# Altium schematic sheet mcu.SchDoc: AudioBound - MCU
size Letter; CheckedBy: J. Brinton; CompanyName: Brinton Engineering, LLC; DrawnBy: J. Brinton; Engineer: J. Brinton; Address1: 3479 Edison Way; Address2: Menlo Park CA 94025; Revision: 1; SheetNumber: 2; SheetTotal: 2
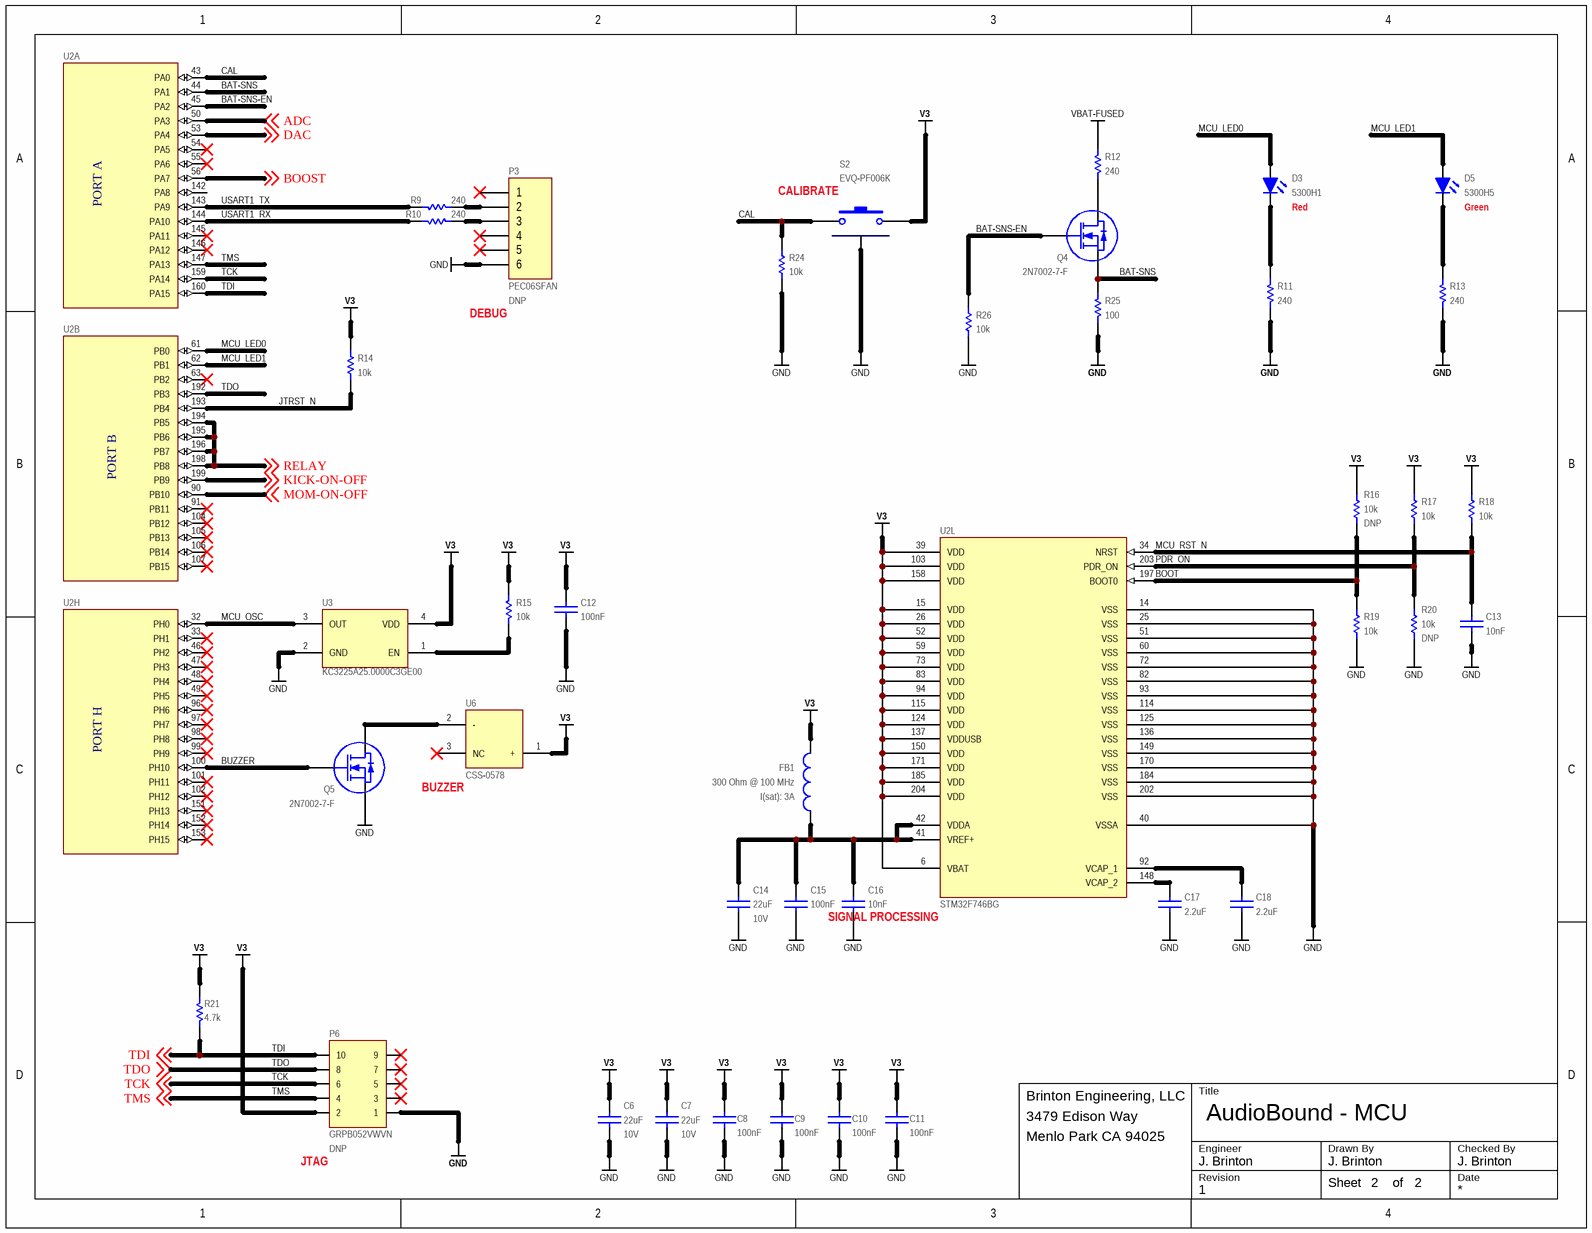
[diagram p0: mcu.SchDoc]

## Parts
C6  value 22uF  Voltage: 10V  [CAPC200X125X145L45N]  (hidden comment: C2012X7S1A226M125)
C7  value 22uF  Voltage: 10V  [CAPC200X125X145L45N]  (hidden comment: C2012X7S1A226M125)
C8  value 100nF  [CAPC100X50X55L25N]  (hidden comment: GCM155R71H104KE02)
C9  value 100nF  [CAPC100X50X55L25N]  (hidden comment: GCM155R71H104KE02)
C10  value 100nF  [CAPC100X50X55L25N]  (hidden comment: GCM155R71H104KE02)
C11  value 100nF  [CAPC100X50X55L25N]  (hidden comment: GCM155R71H104KE02)
C12  value 100nF  [CAPC100X50X55L25N]  (hidden comment: GCM155R71H104KE02)
C13  value 10nF  [CAPC100X50X55L25N]  (hidden comment: GRM155R71H103KA88)
C14  value 22uF  Voltage: 10V  [CAPC200X125X145L45N]  (hidden comment: C2012X7S1A226M125)
C15  value 100nF  [CAPC100X50X55L25N]  (hidden comment: GCM155R71H104KE02)
C16  value 10nF  [CAPC100X50X55L25N]  (hidden comment: GRM155R71H103KA88)
C17  value 2.2uF  [CAPC160X80X90L20N]  (hidden comment: C1608X7R1A225M080)
C18  value 2.2uF  [CAPC160X80X90L20N]  (hidden comment: C1608X7R1A225M080)
D3  5300H1  [5300Hx]
D5  5300H5  [5300Hx]
FB1  value 300 Ohm @ 100 MHz  I(sat): 3A  [0805]  (hidden comment: 742792031)
P3  PEC06SFAN  Do Not Place: DNP  [HDR1X6]
P6  GRPB052VWVN  Do Not Place: DNP  [GRPB052VWVN]
Q4  2N7002-7-F  [SOT23]
Q5  2N7002-7-F  [SOT23]
R9  value 240  [RESC1005X40N]  (hidden comment: ERJ-2RKF2400X)
R10  value 240  [RESC1005X40N]  (hidden comment: ERJ-2RKF2400X)
R11  value 240  [RESC1005X40N]  (hidden comment: ERJ-2RKF2400X)
R12  value 240  [RESC1005X40N]  (hidden comment: ERJ-2RKF2400X)
R13  value 240  [RESC1005X40N]  (hidden comment: ERJ-2RKF2400X)
R14  value 10k  [RESC1005X40N]  (hidden comment: ERJ-2RKF1002X)
R15  value 10k  [RESC1005X40N]  (hidden comment: ERJ-2RKF1002X)
R16  value 10k  Do Not Place: DNP  [RESC1005X40N]  (hidden comment: ERJ-2RKF1002X)
R17  value 10k  [RESC1005X40N]  (hidden comment: ERJ-2RKF1002X)
R18  value 10k  [RESC1005X40N]  (hidden comment: ERJ-2RKF1002X)
R19  value 10k  [RESC1005X40N]  (hidden comment: ERJ-2RKF1002X)
R20  value 10k  Do Not Place: DNP  [RESC1005X40N]  (hidden comment: ERJ-2RKF1002X)
R21  value 4.7k  [RESC1005X40N]  (hidden comment: ERJ-2RKF4701X)
R24  value 10k  [RESC1005X40N]  (hidden comment: ERJ-2RKF1002X)
R25  value 100  [RESC1005X40N]  (hidden comment: ERJ-2RKF1000X)
R26  value 10k  [RESC1005X40N]  (hidden comment: ERJ-2RKF1002X)
S2  EVQ-PF006K  [EVQ-PF006K]
U2  STM32F746BG  [LQFP208]  (value not drawn)  (parts A,B,H,L of 12)
U3  KC3225A25.0000C3GE00  [OSCCC320X250X80L75X100N]
U6  CSS-0578  [CSS-0578]

## Nets
GND: C6.2 C7.2 C8.1 C9.1 C10.1 C11.1 C12.1 C13.1 C14.2 C15.1 C16.1 C17.1 C18.1 P3.6 P6.1 Q5.2(S) R11.2 R13.2 R19.1 R20.1 R24.2 R25.2 R26.2 S2.3 U2.14(VSS) U2.25(VSS) U2.40(VSSA) U2.51(VSS) U2.60(VSS) U2.72(VSS) U2.82(VSS) U2.93(VSS) U2.114(VSS) U2.125(VSS) U2.136(VSS) U2.149(VSS) U2.170(VSS) U2.184(VSS) U2.202(VSS) U3.2(GND)
V3: C6.1 C7.1 C8.2 C9.2 C10.2 C11.2 C12.2 FB1.2 P6.2 R14.2 R15.2 R16.2 R17.2 R18.2 R21.2 S2.2 U2.6(VBAT) U2.15(VDD) U2.26(VDD) U2.39(VDD) U2.52(VDD) U2.59(VDD) U2.73(VDD) U2.83(VDD) U2.94(VDD) U2.103(VDD) U2.115(VDD) U2.124(VDD) U2.137(VDDUSB) U2.150(VDD) U2.158(VDD) U2.171(VDD) U2.185(VDD) U2.204(VDD) U3.4(VDD) U6.1(+)
VBAT-FUSED: R12.1
ADC: U2.50(PA3) ; off-sheet ADC
BAT-SNS: Q4.2(S) R25.1 U2.44(PA1)
BAT-SNS-EN: Q4.1(G) R26.1 U2.45(PA2)
BOOST: U2.56(PA7) ; off-sheet BOOST
BOOT: R16.1 R19.2 U2.197(BOOT0)
BUZZER: Q5.1(G) U2.100(PH10)
CAL: R24.1 S2.1 U2.43(PA0)
DAC: U2.53(PA4) ; off-sheet DAC
JTRST_N: R14.1 U2.193(PB4)
KICK-ON-OFF: U2.199(PB9) ; off-sheet KICK-ON-OFF
MCU_LED0: D3.1(A) U2.61(PB0)
MCU_LED1: D5.1(A) U2.62(PB1)
MCU_OSC: U2.32(PH0) U3.3(OUT)
MCU_RST_N: C13.2 R18.1 U2.34(NRST)
MOM-ON-OFF: U2.90(PB10) ; off-sheet MOM-ON-OFF
PDR_ON: R17.1 R20.2 U2.203(PDR_ON)
RELAY: U2.194(PB5) U2.195(PB6) U2.196(PB7) U2.198(PB8) ; off-sheet RELAY
TCK: P6.6 U2.159(PA14) ; off-sheet TCK
TDI: P6.10 R21.1 U2.160(PA15) ; off-sheet TDI
TDO: P6.8 U2.192(PB3) ; off-sheet TDO
TMS: P6.4 U2.147(PA13) ; off-sheet TMS
USART1_RX: R10.1 U2.144(PA10)
USART1_TX: R9.1 U2.143(PA9)
NetC14_1: C14.1 C15.2 C16.2 FB1.1 U2.41(VREF+) U2.42(VDDA)
NetC17_2: C17.2 U2.148(VCAP_2)
NetC18_2: C18.2 U2.92(VCAP_1)
NetD3_2: D3.2(K) R11.1
NetD5_2: D5.2(K) R13.1
NetP3_2: P3.2 R9.2
NetP3_3: P3.3 R10.2
NetQ4_3: Q4.3(D) R12.2
NetQ5_3: Q5.3(D) U6.2(-)
NetR15_1: R15.1 U3.1(EN)

Not connected (* = marked no-connect by the designer): P3 1* 4* 5*; P6 3* 5* 7* 9*; U2 33(PH1)* 46(PH2)* 47(PH3)* 48(PH4)* 49(PH5)* 54(PA5)* 55(PA6)* 63(PB2)* 91(PB11)* 96(PH6)* 97(PH7)* 98(PH8)* 99(PH9)* 101(PH11)* 102(PH12)* 104(PB12)* 105(PB13)* 106(PB14)* 107(PB15)* 142(PA8) 145(PA11)* 146(PA12)* 151(PH13)* 152(PH14)* 153(PH15)*; U6 3(NC)*

## Notes on the sheet
- (near S2) CALIBRATE
- (near D3) Red
- (near D5) Green
- (near P3) DEBUG
- (near U6) BUZZER
- (near U2) SIGNAL PROCESSING
- (near P6) JTAG
- Title
- Engineer
- Revision
- Drawn By
- Checked By
- Date
- Sheet
- of
- (in symbol STM32F746BGT6, part A) PORT A
- (in symbol STM32F746BGT6, part B) PORT B
- (in symbol STM32F746BGT6, part H) PORT H

## Library data of the parts
C6 C7 C14 = CAP: Ceramic Capacitor 22uF ±20% 10V X7S 0805; Manufacturer: TDK; Tr: -55:125; Manufacturer P/N: C2012X7S1A226M125; Tolerance: ±20%; Package: 0805
C8-C12 C15 = CAP: Ceramic Capacitor 100nF ±10% 50V X7R 0402; Manufacturer: Murata; Tr: -55:125; Voltage: 50V; Manufacturer P/N: GCM155R71H104KE02; Tolerance: ±10%; Footprint: *; Package: 0402
C13 C16 = CAP: Ceramic Capacitor 10nF ±10% 50V X7R 0402; Manufacturer: Murata; Tr: -55:125; Tolerance: ±10%; Manufacturer P/N: GRM155R71H103KA88; Voltage: 50V; Package: 0402
C17 C18 = CAP: Ceramic Capacitor 2.2uF ±20% 10V X7R 0603; Manufacturer: TDK; Tr: -55:125; Tolerance: ±20%; Manufacturer P/N: C1608X7R1A225M080; Package: 0603; Voltage: 10V
D3 = LED0603RD: LED, Color Red, 10mA, 2.0V; Manufacturer: Visual Communications Company; Manufacturer P/N: 5300H1
D5 = LED0603RD: LED, Color Green, 10mA, 2.2V; Manufacturer: Visual Communications Company; Manufacturer P/N: 5300H5
FB1 = INDUCTOR: Ferrite Chip 300 Ohm @ 100MHz; 3A; Manufacturer: Wurth Electronics, Inc; Manufacturer P/N: 742792031; Package: 0805
P3 = Header 6: Header, 6-Pin; Manufacturer: Sullins; Manufacture P/N: PEC06SFAN
P6 = GRPB052VWVN: Male Header, 0.050" Pitch, 2x5 Position, Right Angle; Manufacturer P/N: GRPB052MWCN; Manufacturer: Sullins
Q4 Q5 = 2N7002-7-F: N-Channel Enhancement Mode MOSFET; Manufacturer: Diodes, Inc.; Manufacturer P/N: 2N7002-7-F
R9-R13 = RES: Thick Film Resistor 240 ±1% 0.1W 75V 0402; Manufacturer: Panasonic; Tcr: ±100; Tr: -55:155; Voltage: 75; Power: 0.1; Tolerance: ±1%; Manufacturer P/N: ERJ-2RKF2400X; Alternatives: *; Footprint: *; Package: 0402
R14-R20 R24 R26 = RES: Thick Film Resistor 10k ±1% 0.1W 50V 0402; Manufacturer: Panasonic; Tcr: ±100; Tr: -55:155; Voltage: 50; Power: 0.1; Manufacturer P/N: ERJ-2RKF1002X; Tolerance: ±1%; Alternatives: *; Footprint: *; Package: 0402
R21 = RES: Thick Film Resistor 4.7k ±1% 0.1W 75V 0402; Manufacturer: Panasonic; Tcr: ±100; Tr: -55:155; Voltage: 75; Power: 0.1; Tolerance: ±1%; Manufacturer P/N: ERJ-2RKF4701X; Alternatives: *; Footprint: *; Package: 0402
R25 = RES: Thick Film Resistor 100 ±1% 0.1W 75V 0402; Manufacturer: Panasonic; Tcr: ±100; Tr: -55:155; Voltage: 75; Power: 0.1; Tolerance: ±1%; Manufacturer P/N: ERJ-2RKF1000X; Alternatives: *; Footprint: *; Package: 0402
S2 = EVQ-PF006K: Tactile Switch; Normally Open; Manufacturer: Panasonic; Manufacturer P/N: EVQ-PF006K
U2 = STM32F746BGT6: STM32 Microcontroller; Manufacturer: ST Microelectronics; Manufacturer P/N: STM32F746BG
U3 = OSC_25M_NZ2520SB: Oscillator 25.00Mhz, -+50PPM, 3.3V; Manufacturer: Kyocera; Manufacturer P/N: KC3225A25.0000C3GE00
U6 = CSS-0578: Magnetic Buzzer; Manufacturer: CUI; Manufacturer P/N: CSS-0578